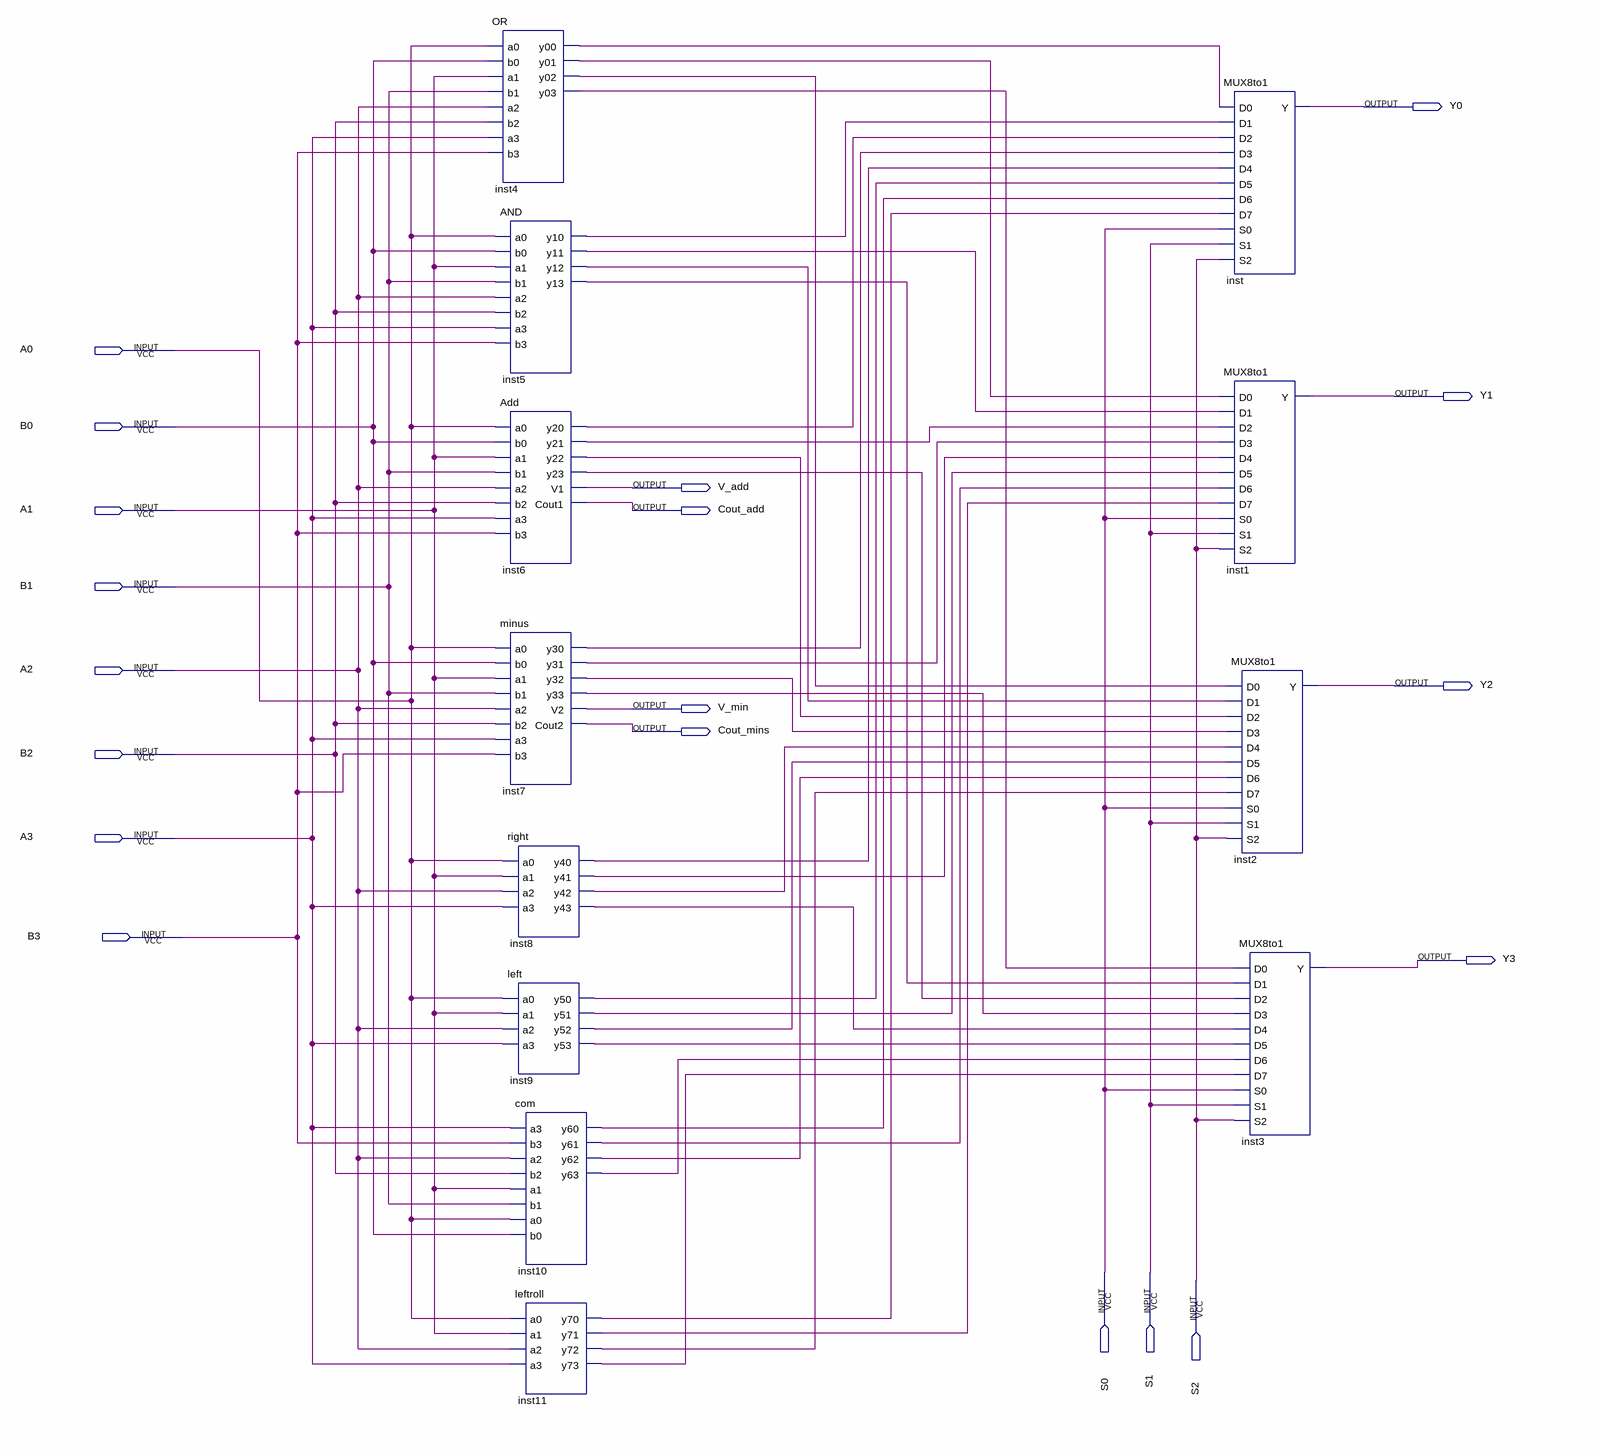
[diagram p0: schematic sheet]
// Quartus schematic ALU.bdf as structural Verilog: 12 symbols, 19 pins
module ALU (
  input  A0,
  input  B0,
  input  A1,
  input  B1,
  input  A2,
  input  B2,
  input  A3,
  input  B3,
  input  S0,
  input  S1,
  input  S2,
  output Y0,
  output Y1,
  output V_add,
  output Cout_add,
  output Y2,
  output V_min,
  output Cout_mins,
  output Y3
);

  wire inst4_y00, inst4_y01, inst4_y02, inst4_y03, inst5_y10, inst5_y11, inst5_y12, inst5_y13, inst6_y20,
       inst6_y21, inst6_y22, inst6_y23, inst7_y30, inst7_y31, inst7_y32, inst7_y33, inst8_y40, inst8_y41,
       inst8_y42, inst8_y43, inst9_y50, inst9_y51, inst9_y52, inst9_y53, inst10_y60, inst10_y61, inst10_y62,
       inst10_y63, inst11_y70, inst11_y71, inst11_y72, inst11_y73;

  OR inst4 (
    .a0(A0), .b0(B0), .a1(A1), .b1(B1), .a2(A2), .b2(B2), .a3(A3), .b3(B3), .y00(inst4_y00), .y01(inst4_y01),
    .y02(inst4_y02), .y03(inst4_y03));
  AND inst5 (
    .a0(A0), .b0(B0), .a1(A1), .b1(B1), .a2(A2), .b2(B2), .a3(A3), .b3(B3), .y10(inst5_y10), .y11(inst5_y11),
    .y12(inst5_y12), .y13(inst5_y13));
  Add inst6 (
    .a0(A0), .b0(B0), .a1(A1), .b1(B1), .a2(A2), .b2(B2), .a3(A3), .b3(B3), .y20(inst6_y20), .y21(inst6_y21),
    .y22(inst6_y22), .y23(inst6_y23), .V1(V_add), .Cout1(Cout_add));
  minus inst7 (
    .a0(A0), .b0(B0), .a1(A1), .b1(B1), .a2(A2), .b2(B2), .a3(A3), .b3(B3), .y30(inst7_y30), .y31(inst7_y31),
    .y32(inst7_y32), .y33(inst7_y33), .V2(V_min), .Cout2(Cout_mins));
  right inst8 (.a0(A0), .a1(A1), .a2(A2), .a3(A3), .y40(inst8_y40), .y41(inst8_y41), .y42(inst8_y42), .y43(inst8_y43));
  left inst9 (.a0(A0), .a1(A1), .a2(A2), .a3(A3), .y50(inst9_y50), .y51(inst9_y51), .y52(inst9_y52), .y53(inst9_y53));
  com inst10 (
    .a3(A3), .b3(B3), .a2(A2), .b2(B2), .a1(A1), .b1(B1), .a0(A0), .b0(B0), .y60(inst10_y60),
    .y61(inst10_y61), .y62(inst10_y62), .y63(inst10_y63));
  leftroll inst11 (
    .a0(A0), .a1(A1), .a2(A2), .a3(A3), .y70(inst11_y70), .y71(inst11_y71), .y72(inst11_y72), .y73(inst11_y73));
  MUX8to1 inst (
    .D0(inst4_y00), .D1(inst5_y10), .D2(inst6_y20), .D3(inst7_y30), .D4(inst8_y40), .D5(inst9_y50),
    .D6(inst10_y60), .D7(inst11_y70), .S0(S0), .S1(S1), .S2(S2), .Y(Y0));
  MUX8to1 inst1 (
    .D0(inst4_y01), .D1(inst5_y11), .D2(inst6_y21), .D3(inst7_y31), .D4(inst8_y41), .D5(inst9_y51),
    .D6(inst10_y61), .D7(inst11_y71), .S0(S0), .S1(S1), .S2(S2), .Y(Y1));
  MUX8to1 inst2 (
    .D0(inst4_y02), .D1(inst5_y12), .D2(inst6_y22), .D3(inst7_y32), .D4(inst8_y42), .D5(inst9_y52),
    .D6(inst10_y62), .D7(inst11_y72), .S0(S0), .S1(S1), .S2(S2), .Y(Y2));
  MUX8to1 inst3 (
    .D0(inst4_y03), .D1(inst5_y13), .D2(inst6_y23), .D3(inst7_y33), .D4(inst8_y43), .D5(inst9_y53),
    .D6(inst10_y63), .D7(inst11_y73), .S0(S0), .S1(S1), .S2(S2), .Y(Y3));
endmodule
